# EAGLE design alu_xor_2bits (EAGLE 6.1)
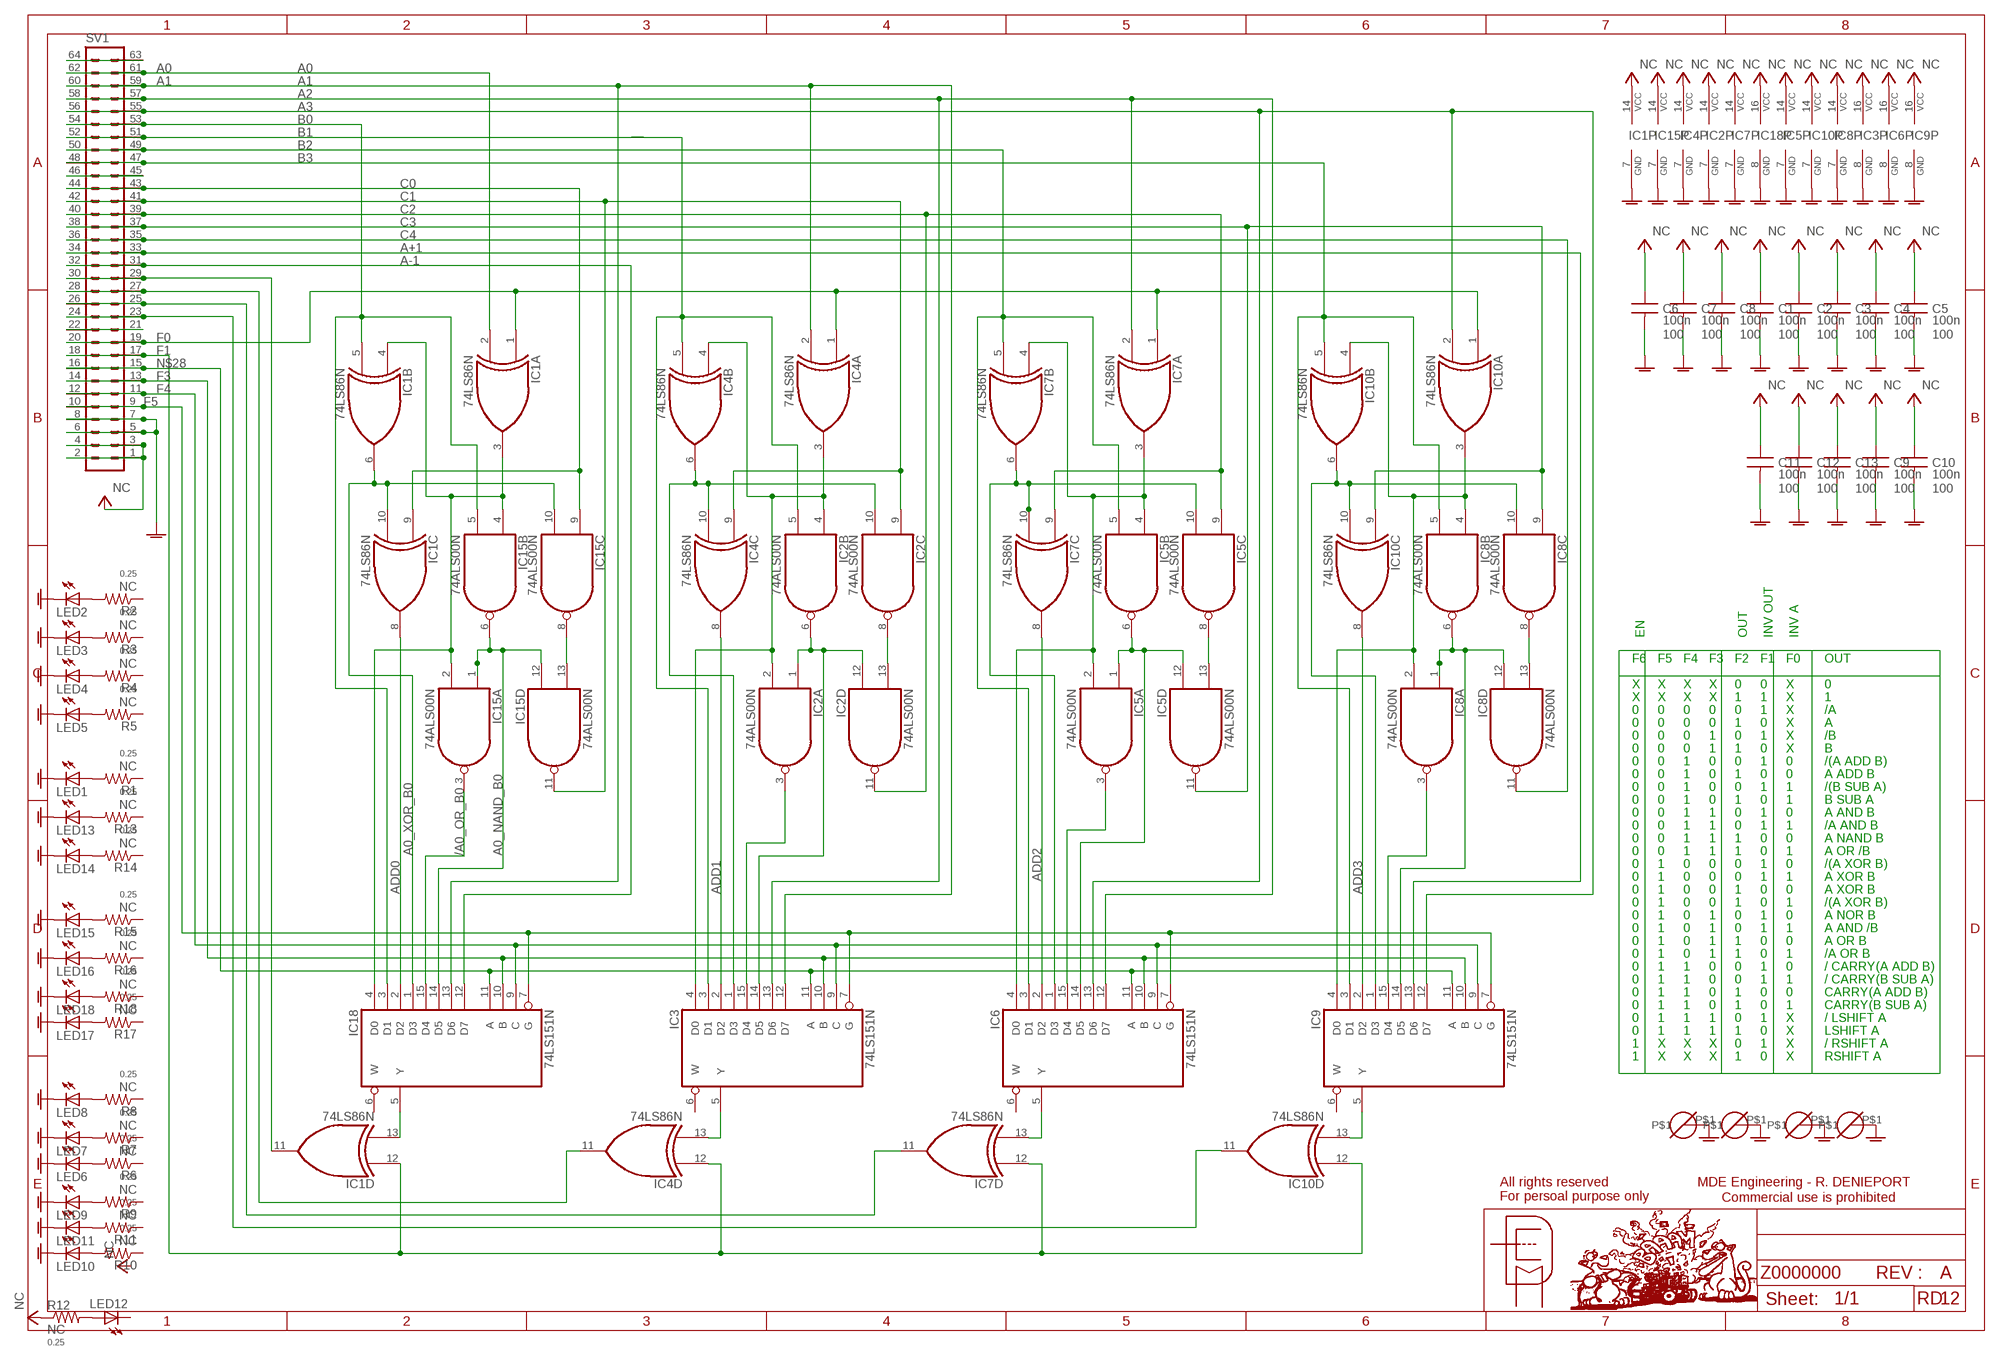
[diagram p0: schematic, sheet 1]
FRAME1 (A3L-LOC): DOC: Z0000000; PCB: A0000000; REV: A; VALUE: NC; YR: 12

## Parts
C1  100n  C2  [C050-030X075]
C2  100n  C2  [C050-030X075]
C3  100n  C2  [C050-030X075]
C4  100n  C2  [C050-030X075]
C5  100n  C2  [C050-030X075]
C6  100n  C2  [C050-030X075]
C7  100n  C2  [C050-030X075]
C8  100n  C2  [C050-030X075]
C9  100n  C2  [C050-030X075]
C10  100n  C2  [C050-030X075]
C11  100n  C2  [C050-030X075]
C12  100n  C2  [C050-030X075]
C13  100n  C2  [C050-030X075]
IC1  74LS86N  [DIL14]
IC2  74ALS00N  [DIL14]
IC3  74LS151N  [DIL16]
IC4  74LS86N  [DIL14]
IC5  74ALS00N  [DIL14]
IC6  74LS151N  [DIL16]
IC7  74LS86N  [DIL14]
IC8  74ALS00N  [DIL14]
IC9  74LS151N  [DIL16]
IC10  74LS86N  [DIL14]
IC15  74ALS00N  [DIL14]
IC18  74LS151N  [DIL16]
LED1  LED3MM  [LED3MM]
LED2  LED3MM  [LED3MM]
LED3  LED3MM  [LED3MM]
LED4  LED3MM  [LED3MM]
LED5  LED3MM  [LED3MM]
LED6  LED3MM  [LED3MM]
LED7  LED3MM  [LED3MM]
LED8  LED3MM  [LED3MM]
LED9  LED3MM  [LED3MM]
LED10  LED3MM  [LED3MM]
LED11  LED3MM  [LED3MM]
LED12  LED3MM  [LED3MM]
LED13  LED3MM  [LED3MM]
LED14  LED3MM  [LED3MM]
LED15  LED3MM  [LED3MM]
LED16  LED3MM  [LED3MM]
LED17  LED3MM  [LED3MM]
LED18  LED3MM  [LED3MM]
R1  NC  R0207H10  [0207/10]
R2  NC  R0207H10  [0207/10]
R3  NC  R0207H10  [0207/10]
R4  NC  R0207H10  [0207/10]
R5  NC  R0207H10  [0207/10]
R6  NC  R0207H10  [0207/10]
R7  NC  R0207H10  [0207/10]
R8  NC  R0207H10  [0207/10]
R9  NC  R0207H10  [0207/10]
R10  NC  R0207H10  [0207/10]
R11  NC  R0207H10  [0207/10]
R12  NC  R0207H10  [0207/10]
R13  NC  R0207H10  [0207/10]
R14  NC  R0207H10  [0207/10]
R15  NC  R0207H10  [0207/10]
R16  NC  R0207H10  [0207/10]
R17  NC  R0207H10  [0207/10]
R18  NC  R0207H10  [0207/10]
SV1  ML64L  [ML64L]
U$1  BANANE_2  [PAD_BANANE]
U$2  BANANE_2  [PAD_BANANE]
U$3  BANANE_2  [PAD_BANANE]
U$4  BANANE_2  [PAD_BANANE]

## Nets
+5V: C1.1 C2.1 C3.1 C4.1 C5.1 C6.1 C7.1 C8.1 C9.1 C10.1 C11.1 C12.1 C13.1 IC1.14(P:VCC) IC2.14(P:VCC) IC3.16(VCC) IC4.14(P:VCC) IC5.14(P:VCC) IC6.16(VCC) IC7.14(P:VCC) IC8.14(P:VCC) IC9.16(VCC) IC10.14(P:VCC) IC15.14(P:VCC) IC18.16(VCC) R12.1 SV1.1 SV1.2 SV1.3 SV1.4 ; supply symbol labelled NC
/A0_OR_B0: IC15.3(A:O) IC18.15(D4)
A0: IC1.2(A:I1) SV1.61 SV1.62
A0_NAND_B0: IC15.1(A:I0) IC15.6(B:O) IC15.12(D:I0) IC18.14(D5)
A0_XOR_B0: IC1.6(B:O) IC1.10(C:I1) IC15.10(C:I1) IC18.1(D3)
A1: IC3.12(D7) IC4.2(A:I1) IC18.13(D6) SV1.59 SV1.60
A2: IC3.13(D6) IC6.12(D7) IC7.2(A:I1) SV1.57 SV1.58
A3: IC6.13(D6) IC9.12(D7) IC10.2(A:I1) SV1.55 SV1.56
A+1: IC9.13(D6) SV1.33 SV1.34
A-1: IC18.12(D7) SV1.31 SV1.32
ADD0: IC1.8(C:O) IC18.2(D2)
ADD1: IC3.2(D2) IC4.8(C:O)
ADD2: IC6.2(D2) IC7.8(C:O)
ADD3: IC9.2(D2) IC10.8(C:O)
B0: IC1.5(B:I1) IC15.5(B:I1) IC18.3(D1) SV1.53 SV1.54
B1: IC2.5(B:I1) IC3.3(D1) IC4.5(B:I1) SV1.51 SV1.52
B2: IC5.5(B:I1) IC6.3(D1) IC7.5(B:I1) SV1.49 SV1.50
B3: IC8.5(B:I1) IC9.3(D1) IC10.5(B:I1) SV1.47 SV1.48
C0: IC1.9(C:I0) IC15.9(C:I0) SV1.43 SV1.44
C1: IC2.9(C:I0) IC4.9(C:I0) IC15.11(D:O) SV1.41 SV1.42
C2: IC2.11(D:O) IC5.9(C:I0) IC7.9(C:I0) SV1.39 SV1.40
C3: IC5.11(D:O) IC8.9(C:I0) IC10.9(C:I0) SV1.37 SV1.38
C4: IC8.11(D:O) SV1.35 SV1.36
F0: IC1.1(A:I0) IC4.1(A:I0) IC7.1(A:I0) IC10.1(A:I0) SV1.19 SV1.20
F1: IC1.12(D:I0) IC4.12(D:I0) IC7.12(D:I0) IC10.12(D:I0) SV1.17 SV1.18
F3: IC3.10(B) IC6.10(B) IC9.10(B) IC18.10(B) SV1.13 SV1.14
F4: IC3.9(C) IC6.9(C) IC9.9(C) IC18.9(C) SV1.11 SV1.12
F5: IC3.7(G) IC6.7(G) IC9.7(G) IC18.7(G) SV1.9 SV1.10
GNDA: C1.2 C2.2 C3.2 C4.2 C5.2 C6.2 C7.2 C8.2 C9.2 C10.2 C11.2 C12.2 C13.2 IC1.7(P:GND) IC2.7(P:GND) IC3.8(GND) IC4.7(P:GND) IC5.7(P:GND) IC6.8(GND) IC7.7(P:GND) IC8.7(P:GND) IC9.8(GND) IC10.7(P:GND) IC15.7(P:GND) IC18.8(GND) LED1.K(C) LED2.K(C) LED3.K(C) LED4.K(C) LED5.K(C) LED6.K(C) LED7.K(C) LED8.K(C) LED9.K(C) LED10.K(C) LED11.K(C) LED13.K(C) LED14.K(C) LED15.K(C) LED16.K(C) LED17.K(C) LED18.K(C) SV1.5 SV1.6 SV1.7 SV1.8 U$1.P$1 U$2.P$1 U$3.P$1 U$4.P$1 ; supply symbol labelled NC
N$1: SV1.45 SV1.46
N$3: IC2.8(C:O) IC2.13(D:I1)
N$4: LED1.A R1.2
N$5: IC1.3(A:O) IC1.4(B:I0) IC15.2(A:I1) IC15.4(B:I0) IC18.4(D0)
N$6: LED2.A R2.2
N$7: LED3.A R3.2
N$8: LED4.A R4.2
N$9: LED5.A R5.2
N$10: LED6.A R6.2
N$11: LED7.A R7.2
N$12: LED8.A R8.2
N$13: LED9.A R9.2
N$14: LED10.A R10.2
N$15: LED11.A R11.2
N$16: LED12.A R12.2
N$17: LED13.A R13.2
N$19: LED14.A R14.2
N$20: LED15.A R15.2
N$21: IC2.2(A:I1) IC2.4(B:I0) IC3.4(D0) IC4.3(A:O) IC4.4(B:I0)
N$22: LED16.A R16.2
N$23: IC1.13(D:I1) IC18.5(Y)
N$25: LED17.A R17.2
N$26: LED18.A R18.2
N$27: IC3.5(Y) IC4.13(D:I1)
N$28: IC3.11(A) IC6.11(A) IC9.11(A) IC18.11(A) SV1.15 SV1.16
N$29: IC5.8(C:O) IC5.13(D:I1)
N$30: IC1.11(D:O) SV1.29 SV1.30
N$31: SV1.63 SV1.64
N$32: IC5.2(A:I1) IC5.4(B:I0) IC6.4(D0) IC7.3(A:O) IC7.4(B:I0)
N$34: IC6.5(Y) IC7.13(D:I1)
N$35: IC2.10(C:I1) IC3.1(D3) IC4.6(B:O) IC4.10(C:I1)
N$36: IC8.8(C:O) IC8.13(D:I1)
N$37: IC8.2(A:I1) IC8.4(B:I0) IC9.4(D0) IC10.3(A:O) IC10.4(B:I0)
N$39: IC9.5(Y) IC10.13(D:I1)
N$40: IC2.3(A:O) IC3.15(D4)
N$41: IC2.1(A:I0) IC2.6(B:O) IC2.12(D:I0) IC3.14(D5)
N$42: IC5.10(C:I1) IC6.1(D3) IC7.6(B:O) IC7.10(C:I1)
N$44: IC5.1(A:I0) IC5.6(B:O) IC5.12(D:I0) IC6.14(D5)
N$45: SV1.21 SV1.22
N$46: IC10.11(D:O) SV1.23 SV1.24
N$47: IC7.11(D:O) SV1.25 SV1.26
N$48: IC4.11(D:O) SV1.27 SV1.28
N$49: IC5.3(A:O) IC6.15(D4)
N$50: IC8.3(A:O) IC9.15(D4)
N$51: IC8.1(A:I0) IC8.6(B:O) IC8.12(D:I0) IC9.14(D5)
N$52: IC8.10(C:I1) IC9.1(D3) IC10.6(B:O) IC10.10(C:I1)
N$61: IC15.8(C:O) IC15.13(D:I1)
Unconnected: IC3.6(W) IC6.6(W) IC9.6(W) IC18.6(W) LED12.K(C) R1.1 R2.1 R3.1 R4.1 R5.1 R6.1 R7.1 R8.1 R9.1 R10.1 R11.1 R13.1 R14.1 R15.1 R16.1 R17.1 R18.1

## Notes on the sheet
- EN | OUT | INV OUT | INV A
- F6 | F5 | F4 | F3 | F2 | F1 | F0 | OUT
- X | X | X | X | 0 | 0 | X | 0
- X | X | X | X | 1 | 1 | X | 1
- 0 | 0 | 0 | 0 | 0 | 1 | X | /A
- 0 | 0 | 0 | 0 | 1 | 0 | X | A
- 0 | 0 | 0 | 1 | 0 | 1 | X | /B
- 0 | 0 | 0 | 1 | 1 | 0 | X | B
- 0 | 0 | 1 | 0 | 0 | 1 | 0 | /(A ADD B)
- 0 | 0 | 1 | 0 | 1 | 0 | 0 | A ADD B
- 0 | 0 | 1 | 0 | 0 | 1 | 1 | /(B SUB A)
- 0 | 0 | 1 | 0 | 1 | 0 | 1 | B SUB A
- 0 | 0 | 1 | 1 | 0 | 1 | 0 | A AND B
- 0 | 0 | 1 | 1 | 0 | 1 | 1 | /A AND B
- 0 | 0 | 1 | 1 | 1 | 0 | 0 | A NAND B
- 0 | 0 | 1 | 1 | 1 | 0 | 1 | A OR /B
- 0 | 1 | 0 | 0 | 0 | 1 | 0 | /(A XOR B)
- 0 | 1 | 0 | 0 | 0 | 1 | 1 | A XOR B
- 0 | 1 | 0 | 0 | 1 | 0 | 0 | A XOR B
- 0 | 1 | 0 | 0 | 1 | 0 | 1 | /(A XOR B)
- 0 | 1 | 0 | 1 | 0 | 1 | 0 | A NOR B
- 0 | 1 | 0 | 1 | 0 | 1 | 1 | A AND /B
- 0 | 1 | 0 | 1 | 1 | 0 | 0 | A OR B
- 0 | 1 | 0 | 1 | 1 | 0 | 1 | /A OR B
- 0 | 1 | 1 | 0 | 0 | 1 | 0 | / CARRY(A ADD B)
- 0 | 1 | 1 | 0 | 0 | 1 | 1 | / CARRY(B SUB A)
- 0 | 1 | 1 | 0 | 1 | 0 | 0 | CARRY(A ADD B)
- 0 | 1 | 1 | 0 | 1 | 0 | 1 | CARRY(B SUB A)
- 0 | 1 | 1 | 1 | 0 | 1 | X | / LSHIFT A
- 0 | 1 | 1 | 1 | 1 | 0 | X | LSHIFT A
- 1 | X | X | X | 0 | 1 | X | / RSHIFT A
- 1 | X | X | X | 1 | 0 | X | RSHIFT A

## Library data of the parts
C1-C13 = MDE:C; GEOMETRIE: 2.5X7.5; TENSION: 100; TYPE: CONDENSATEUR
IC1 IC4 IC7 IC10 = 74xx-us:74*86: Quad 2-input EXCLUSIV-OR (XOR) gate
IC2 IC5 IC8 IC15 = 74xx-us:74*00: Quad 2-input NAND gate
IC3 IC6 IC9 IC18 = 74xx-us:74*151: Data SELECTOR/MULTIPLEXER
LED1-LED18 = led:LED: LED OSRAM: - CHIPLED LG R971, LG N971, LY N971, LG Q971, LY Q971, LO R971, LY R971 LH N974, LH R974 LS Q976, LO Q976, LY Q976 LO Q996 - Hyper CHIPLED LW Q18S LB Q993, LB Q99A, LB R99A - SideLED LS A670, LO A670, LY A670, LG A670, LP A670 LB A673, LV A673, LT A673, LW A673 LH A674 LY A675 LS A676, LA A676, LO A676, LY A676, LW A676 LS A679, LY A679, LG A679 - Hyper Micro SIDELED® LS Y876, LA Y876, LO Y876, LY Y876 LT Y87S - SmartLED LW L88C, LW L88S LB L89C, LB L89S, LG L890 LS L89K, LO L89K, LY L89K LS L896, LA L896, LO L896, LY L896 - TOPLED LS T670, LO T670, LY T670, LG T670, LP T670 LSG T670, LSP T670, LSY T670, LOP T670, LYG T670 LG T671, LOG T671, LSG T671 LB T673, LV T673, LT T673, LW T673 LH T674 LS T676, LA T676, LO T676, LY T676, LB T676, LH T676, LSB T676, LW T676 LB T67C, LV T67C, LT T67C, LS T67K, LO T67K, LY T67K, LW E67C LS E67B, LA E67B, LO E67B, LY E67B, LB E67C, LV E67C, LT E67C LW T67C LS T679, LY T679, LG T679 LS T770, LO T770, LY T770, LG T770, LP T770 LB T773, LV T773, LT T773, LW T773 LH T774 LS E675, LA E675, LY E675, LS T675 LS T776, LA T776, LO T776, LY T776, LB T776 LHGB T686 LT T68C, LB T68C - Hyper Mini TOPLED® LB M676 - Mini TOPLED Santana® LG M470 LS M47K, LO M47K, LY M47K Source: http://www.osram.convergy.de LUXEON: - LUMILED® LXK2-PW12-R00, LXK2-PW12-S00, LXK2-PW14-U00, LXK2-PW14-V00 LXK2-PM12-R00, LXK2-PM12-S00, LXK2-PM14-U00 LXK2-PE12-Q00, LXK2-PE12-R00, LXK2-PE12-S00, LXK2-PE14-T00, LXK2-PE14-U00 LXK2-PB12-K00, LXK2-PB12-L00, LXK2-PB12-M00, LXK2-PB14-N00, LXK2-PB14-P00, LXK2-PB14-Q00 LXK2-PR12-L00, LXK2-PR12-M00, LXK2-PR14-Q00, LXK2-PR14-R00 LXK2-PD12-Q00, LXK2-PD12-R00, LXK2-PD12-S00 LXK2-PH12-R00, LXK2-PH12-S00 LXK2-PL12-P00, LXK2-PL12-Q00, LXK2-PL12-R00 Source: www.luxeon.com KINGBRIGHT: KA-3528ASYC Source: www.kingbright.com
R1-R18 = MDE:R; GEOMETRIE: 0207; PUISSANCE: 0.25; TYPE: RESISTANCE
SV1 = con-harting-ml:ML64: HARTING; OC_FARNELL: unknown; OC_NEWARK: unknown
U$1-U$4 = MDE:BANANE_2

## Board
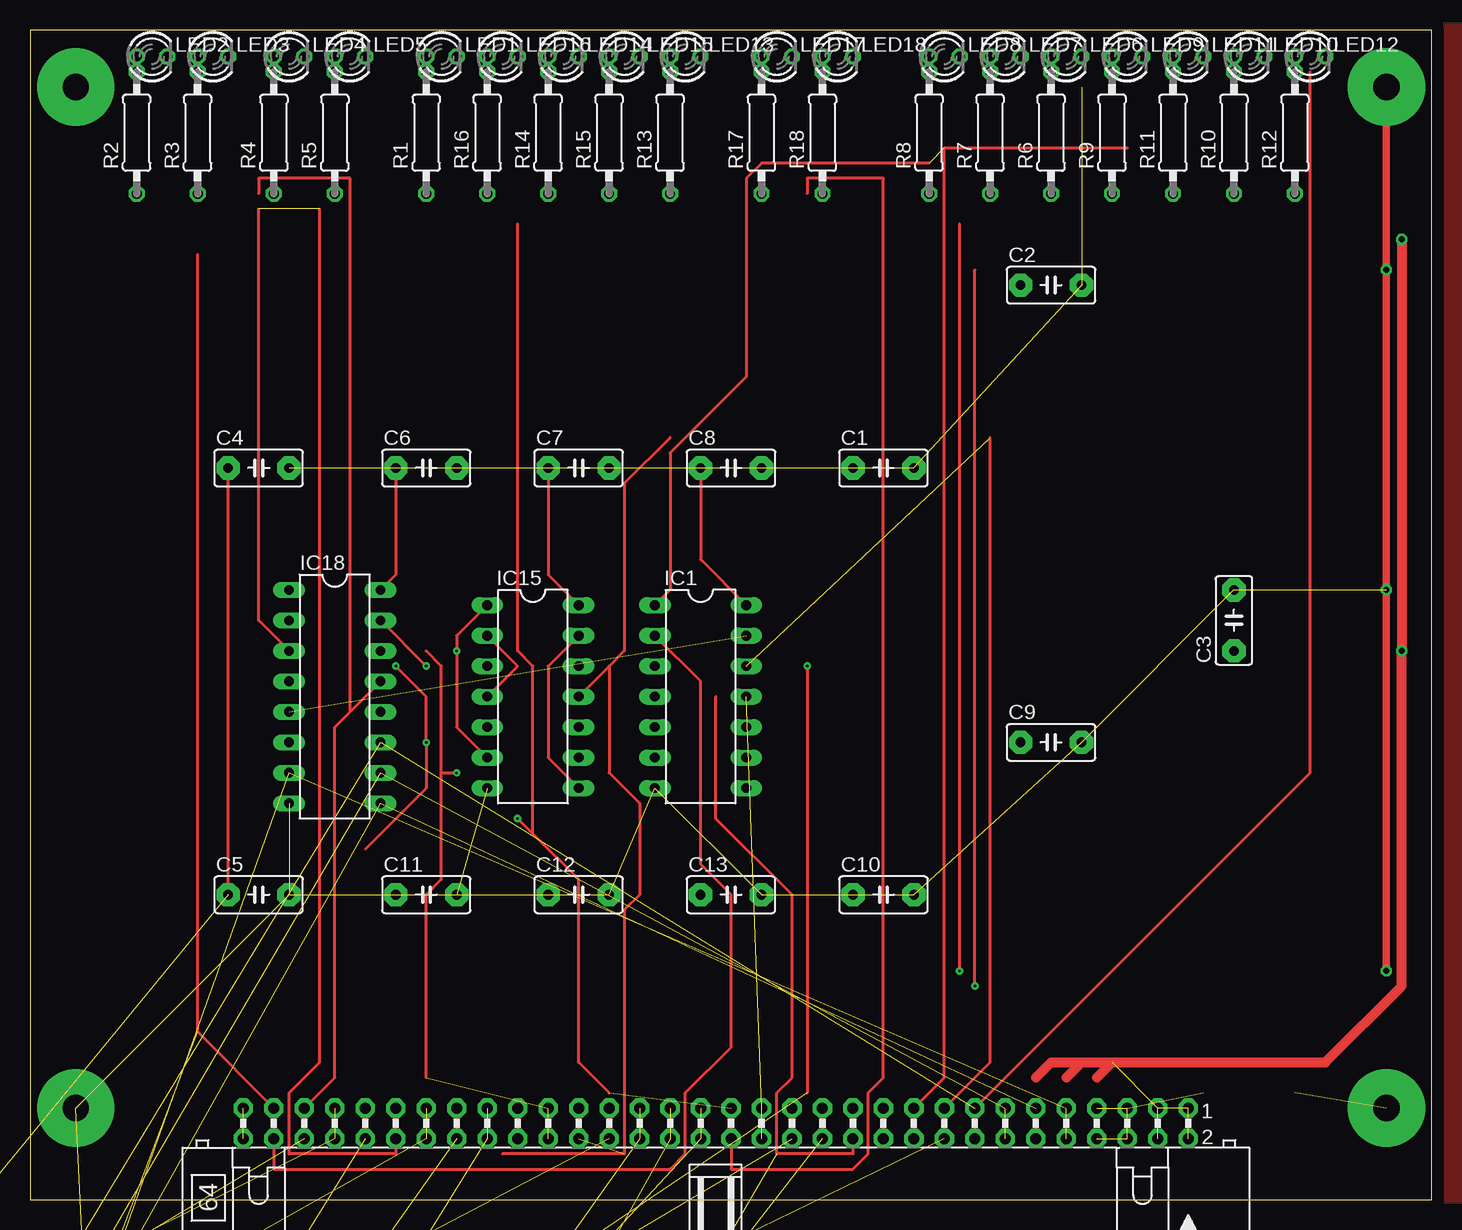
[diagram p1: board, top side]
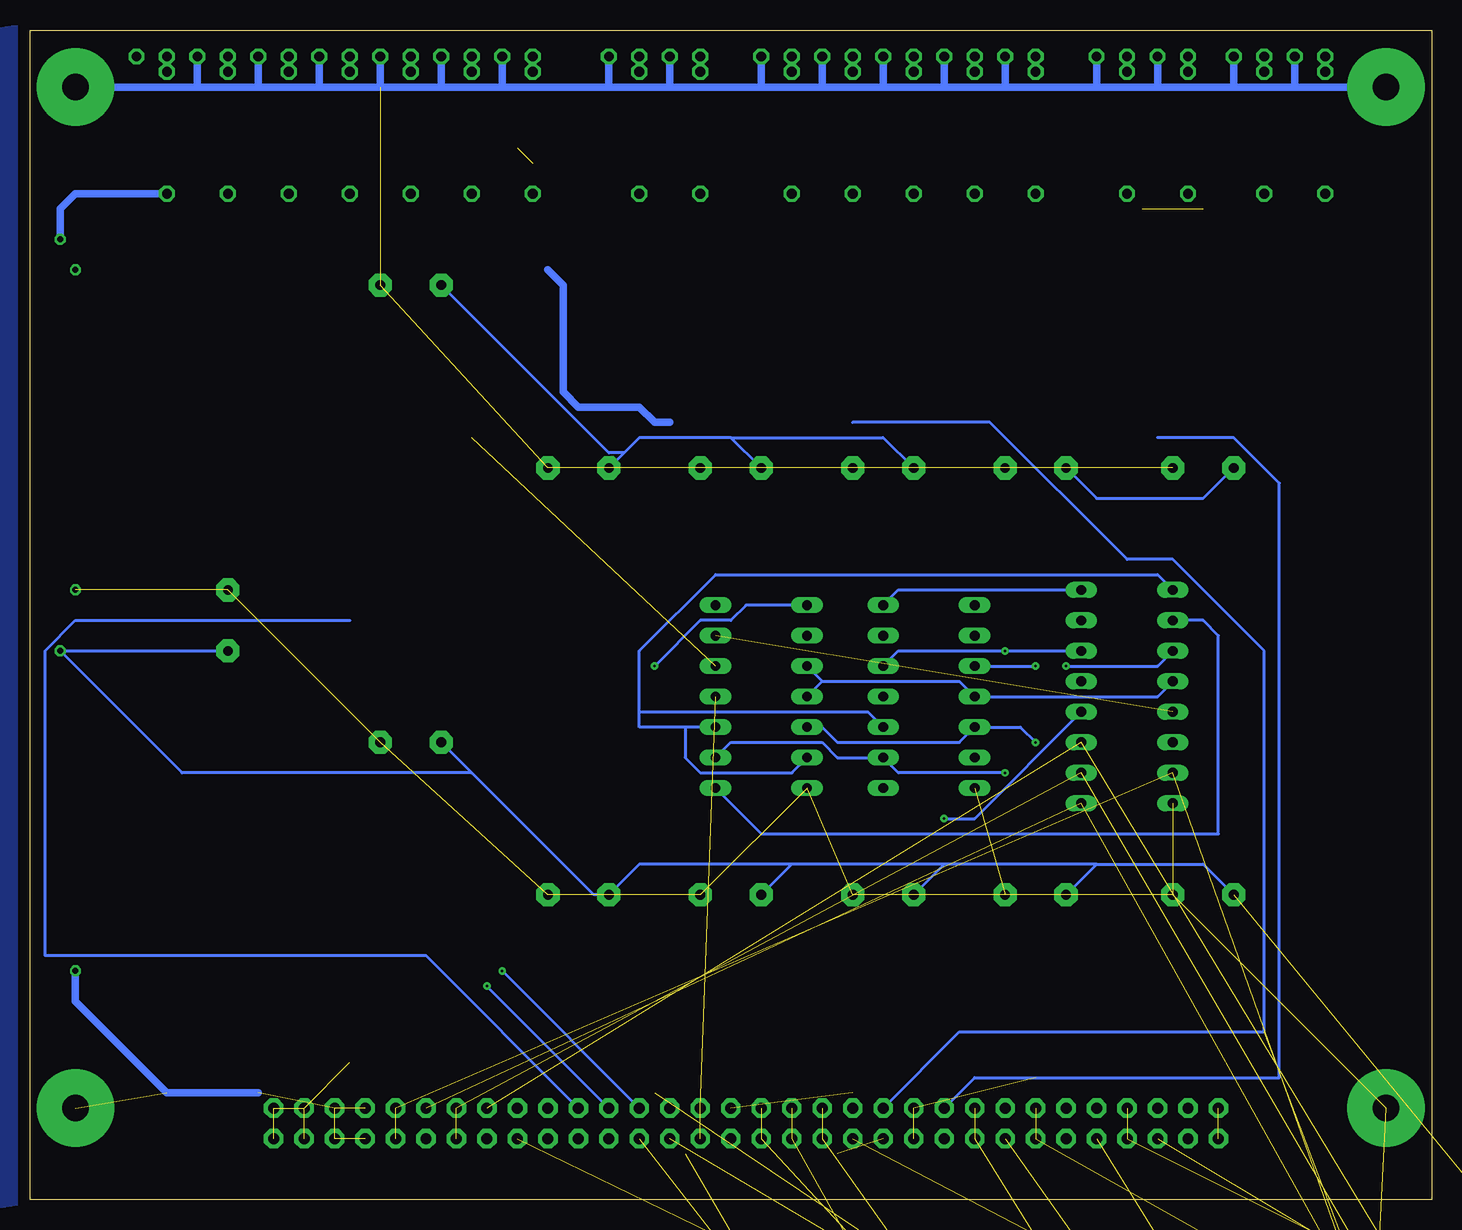
[diagram p2: board, bottom side, seen from below]

Size 116.82 x 97.46 mm. Coordinates in mm from the lower left corner, seen from the top.
Outline: 0,0 116.82,0 116.82,97.46 0,97.46 0,0
Copper layers (1*16): Top 0.035mm / dielectric 1.5mm / Bottom 0.035mm
Design rules: minimum track width 10mil, minimum drill 0.21mm, track to track 11mil, track to pad 12mil, pad to pad 12mil, via to via 12mil, smd to smd 8mil, copper to edge 40mil, drill to drill 8mil, minimum pad ring 10mil, minimum via ring 8mil, stop-mask expansion 4mil, vias tented up to drill 0mil, thermal gap 10mil

### Footprints (pad centres in the part's own frame; a part is rotated, then mirrored left to right if it is on the bottom)
C050-030X075 = drill 0.813 pad 1.93 octagon: 1 -2.54,0; 2 2.54,0
DIL14 = drill 0.813 long: 1 -7.62,-3.81; 2 -5.08,-3.81; 3 -2.54,-3.81; 4 0,-3.81; 5 2.54,-3.81; 6 5.08,-3.81; 7 7.62,-3.81; 8 7.62,3.81; 9 5.08,3.81; 10 2.54,3.81; 11 0,3.81; 12 -2.54,3.81; 13 -5.08,3.81; 14 -7.62,3.81
DIL16 = drill 0.813 long: 1 -8.89,-3.81; 2 -6.35,-3.81; 3 -3.81,-3.81; 4 -1.27,-3.81; 5 1.27,-3.81; 6 3.81,-3.81; 7 6.35,-3.81; 8 8.89,-3.81; 9 8.89,3.81; 10 6.35,3.81; 11 3.81,3.81; 12 1.27,3.81; 13 -1.27,3.81; 14 -3.81,3.81; 15 -6.35,3.81; 16 -8.89,3.81
LED3MM = drill 0.813 octagon: A -1.27,0; K 1.27,0
0207/10 = drill 0.813 octagon: 1 -5.08,0; 2 5.08,0
ML64L = drill 0.914 pad 1.6 octagon: 1 -39.37,-1.27; 2 -39.37,1.27; 3 -36.83,-1.27; 4 -36.83,1.27; 5 -34.29,-1.27; 6 -34.29,1.27; 7 -31.75,-1.27; 8 -31.75,1.27; 9 -29.21,-1.27; 10 -29.21,1.27; 11 -26.67,-1.27; 12 -26.67,1.27; 13 -24.13,-1.27; 14 -24.13,1.27; 15 -21.59,-1.27; 16 -21.59,1.27; 17 -19.05,-1.27; 18 -19.05,1.27; 19 -16.51,-1.27; 20 -16.51,1.27; 21 -13.97,-1.27; 22 -13.97,1.27; 23 -11.43,-1.27; 24 -11.43,1.27; 25 -8.89,-1.27; 26 -8.89,1.27; 27 -6.35,-1.27; 28 -6.35,1.27; 29 -3.81,-1.27; 30 -3.81,1.27; 31 -1.27,-1.27; 32 -1.27,1.27; 33 1.27,-1.27; 34 1.27,1.27; 35 3.81,-1.27; 36 3.81,1.27; 37 6.35,-1.27; 38 6.35,1.27; 39 8.89,-1.27; 40 8.89,1.27; 41 11.43,-1.27; 42 11.43,1.27; 43 13.97,-1.27; 44 13.97,1.27; 45 16.51,-1.27; 46 16.51,1.27; 47 19.05,-1.27; 48 19.05,1.27; 49 21.59,-1.27; 50 21.59,1.27; 51 24.13,-1.27; 52 24.13,1.27; 53 26.67,-1.27; 54 26.67,1.27; 55 29.21,-1.27; 56 29.21,1.27; 57 31.75,-1.27; 58 31.75,1.27; 59 34.29,-1.27; 60 34.29,1.27; 61 36.83,-1.27; 62 36.83,1.27; 63 39.37,-1.27; 64 39.37,1.27
PAD_BANANE = drill 2.2 pad 6.452: P$1 0,0

### Placement (x,y rotation side)
C1  71.12,60.96 0 top
C2  85.09,76.2 0 top
C3  100.33,48.26 90 top
C4  19.05,60.96 0 top
C5  19.05,25.4 0 top
C6  33.02,60.96 0 top
C7  45.72,60.96 0 top
C8  58.42,60.96 0 top
C9  85.09,38.1 0 top
C10  71.12,25.4 0 top
C11  33.02,25.4 0 top
C12  45.72,25.4 0 top
C13  58.42,25.4 0 top
IC1  55.88,41.91 270 top
IC2  -5.08,-26.67 0 top  (outside the outline)
IC3  -3.81,-13.97 0 top  (outside the outline)
IC4  -5.08,-39.37 0 top  (outside the outline)
IC5  -5.08,-77.47 0 top  (outside the outline)
IC6  -3.81,-52.07 0 top  (outside the outline)
IC7  -5.08,-90.17 0 top  (outside the outline)
IC8  -5.08,-102.87 0 top  (outside the outline)
IC9  -3.81,-64.77 0 top  (outside the outline)
IC10  -5.08,-115.57 0 top  (outside the outline)
IC15  41.91,41.91 270 top
IC18  25.4,41.91 270 top
LED1  34.29,95.25 0 top
LED2  10.16,95.25 0 top
LED3  15.24,95.25 0 top
LED4  21.59,95.25 0 top
LED5  26.67,95.25 0 top
LED6  86.36,95.25 0 top
LED7  81.28,95.25 0 top
LED8  76.2,95.25 0 top
LED9  91.44,95.25 0 top
LED10  101.6,95.25 0 top
LED11  96.52,95.25 0 top
LED12  106.68,95.25 0 top
LED13  54.61,95.25 0 top
LED14  44.45,95.25 0 top
LED15  49.53,95.25 0 top
LED16  39.37,95.25 0 top
LED17  62.23,95.25 0 top
LED18  67.31,95.25 0 top
R1  33.02,88.9 90 top
R2  8.89,88.9 90 top
R3  13.97,88.9 90 top
R4  20.32,88.9 90 top
R5  25.4,88.9 90 top
R6  85.09,88.9 90 top
R7  80.01,88.9 90 top
R8  74.93,88.9 90 top
R9  90.17,88.9 90 top
R10  100.33,88.9 90 top
R11  95.25,88.9 90 top
R12  105.41,88.9 90 top
R13  53.34,88.9 90 top
R14  43.18,88.9 90 top
R15  48.26,88.9 90 top
R16  38.1,88.9 90 top
R17  60.96,88.9 90 top
R18  66.04,88.9 90 top
SV1  57.15,6.35 180 top
U$1  3.81,7.62 0 top
U$2  113.03,7.62 0 top
U$3  3.81,92.71 0 top
U$4  113.03,92.71 0 top

### Tracks (layer width: path | path; a pad name or v marks a point on that pad's centre or on a via)
+5V  (via drill 0.5 pad 0.81)  (13 unrouted)
  Top 0.254: IC18.16 30.48,52.07 C6.1 | IC15.14 43.18,52.07 C7.1 | IC1.14 55.88,53.34 C8.1 | C5.1 C4.1
  Top 0.813: v114.3,80.01 v114.3,45.72 114.3,17.78 107.95,11.43 90.17,11.43 | 83.82,10.16 85.09,11.43 87.63,11.43 | 87.63,11.43 90.17,11.43 | 86.36,10.16 87.63,11.43 | 88.9,10.16 90.17,11.43
  Bottom 0.254: C4.1 19.05,58.42 27.94,58.42 C6.1 | 67.31,62.23 66.04,63.5 58.42,63.5 | 67.31,62.23 C1.1 | C8.1 58.42,63.5 | C2.1 68.58,62.23 67.31,62.23 | C7.1 45.72,63.5 58.42,63.5 | IC18.16 44.45,50.8 IC15.14 | C3.1 v114.3,45.72 104.14,35.56 80.01,35.56 | C5.1 19.05,27.94 27.94,27.94 | C11.1 27.94,27.94 | 40.64,27.94 C12.1 | 27.94,27.94 40.64,27.94 | 53.34,27.94 C13.1 | 40.64,27.94 53.34,27.94 | 53.34,27.94 66.04,27.94 C10.1 69.85,25.4 80.01,35.56 | 80.01,35.56 C9.1
  Bottom 0.61: R12.1 113.03,83.82 114.3,82.55 v114.3,80.01
/A0_OR_B0  (via drill 0.21)
  Top 0.254: v33.02,44.45 IC18.15
  Bottom 0.254: IC15.3 v33.02,44.45
A0
  Top 0.254: IC1.2 55.88,43.18 55.88,27.94 58.42,25.4 58.42,12.7 54.61,8.89 54.61,3.81 53.34,2.54 20.32,2.54 SV1.62 SV1.61 13.97,13.97 13.97,78.74
A0_NAND_B0  (via drill 0.21)
  Top 0.254: IC15.6 35.56,39.37 v35.56,45.72 35.56,46.99 IC15.1
  Bottom 0.254: IC18.14 v35.56,45.72 44.45,45.72 IC15.12
A0_XOR_B0
  Bottom 0.254: IC1.6 53.34,35.56 60.96,35.56 62.23,36.83 62.23,39.37 | IC1.10 62.23,39.37 | IC18.1 22.86,52.07 59.69,52.07 66.04,45.72 66.04,40.64 | 66.04,40.64 66.04,39.37 62.23,39.37 | IC15.10 46.99,40.64 66.04,40.64
A1  (2 unrouted)
  Top 0.254: 26.67,40.64 25.4,39.37 25.4,10.16 SV1.59 SV1.60 | 26.67,40.64 IC18.13 | 19.05,83.82 19.05,85.09 26.67,85.09 26.67,40.64
A2  (4 unrouted)
A3  (3 unrouted)
  Top 0.254: SV1.55 SV1.56
A+1  (2 unrouted)
A-1  (via drill 0.21)  (1 unrouted)
  Top 0.254: 41.91,30.48 45.72,26.67 45.72,11.43 48.26,8.89 | 41.91,30.48 v40.64,31.75 | 40.64,81.28 40.64,45.72 41.91,44.45 41.91,30.48 | 64.77,83.82 64.77,85.09 71.12,85.09 71.12,10.16 69.85,8.89 69.85,3.81 68.58,2.54 58.42,2.54 SV1.32 SV1.31
  Bottom 0.254: IC18.12 38.1,31.75 v40.64,31.75
ADD0
  Bottom 0.254: IC18.2 19.05,48.26 17.78,46.99 17.78,30.48 55.88,30.48 IC1.8
ADD1  (1 unrouted)
ADD2  (1 unrouted)
ADD3  (1 unrouted)
B0  (via drill 0.21)  (1 unrouted)
  Top 0.254: 19.05,82.55 19.05,48.26 IC18.3 | 27.94,29.21 33.02,34.29 v33.02,38.1 33.02,41.91 v30.48,44.45 | 24.13,82.55 24.13,11.43 21.59,8.89 21.59,3.81 30.48,3.81 SV1.54 SV1.53
  Bottom 0.254: IC1.5 50.8,39.37 49.53,38.1 39.37,38.1 IC15.5 34.29,39.37 v33.02,38.1 | IC18.3 22.86,44.45 v30.48,44.45
B1  (4 unrouted)
B2  (3 unrouted)
  Top 0.254: SV1.49 SV1.50
B3  (4 unrouted)
C0  (via drill 0.21)  (2 unrouted)
  Top 0.254: 33.02,45.72 34.29,44.45 34.29,35.56 | 34.29,35.56 34.29,26.67 33.02,25.4 33.02,10.16 | 34.29,35.56 v35.56,35.56
  Bottom 0.254: IC1.9 58.42,38.1 50.8,38.1 49.53,36.83 IC15.9 44.45,35.56 v35.56,35.56
C1  (3 unrouted)
  Top 0.254: 48.26,44.45 49.53,45.72 49.53,59.69 53.34,63.5 | 48.26,44.45 IC15.11 | 39.37,3.81 49.53,3.81 49.53,24.13 50.8,25.4 50.8,33.02 48.26,35.56 48.26,44.45 | SV1.41 SV1.42
  Bottom 0.254: 48.26,64.77 36.83,64.77 25.4,53.34 21.59,53.34 13.97,45.72 13.97,13.97 39.37,13.97 SV1.41
C2  (3 unrouted)
  Top 0.254: SV1.39 SV1.40
C3  (4 unrouted)
C4  (2 unrouted)
F0  (via drill 0.21)  (4 unrouted)
  Top 0.254: IC1.1 53.34,50.8 53.34,62.23 59.69,68.58 59.69,85.09 60.96,86.36 74.93,86.36 | v64.77,44.45 64.77,8.89 | 91.44,87.63 76.2,87.63 76.2,10.16 SV1.19 SV1.20
  Bottom 0.254: v64.77,44.45 60.96,48.26 58.42,48.26 57.15,49.53 IC1.1
F1  (4 unrouted)
  Top 0.254: 80.01,63.5 80.01,11.43 SV1.17 SV1.18
F3  (5 unrouted)
F4  (4 unrouted)
  Top 0.254: SV1.11 SV1.12
F5  (5 unrouted)
GNDA  (via drill 0.5 pad 0.81)  (31 unrouted)
  Top 0.61: U$4.P$1 v113.03,77.47 v113.03,50.8 v113.03,19.05
  Bottom 0.61: LED2.K 11.43,92.71 | 11.43,92.71 16.51,92.71 | 16.51,92.71 22.86,92.71 | 22.86,92.71 27.94,92.71 | 27.94,92.71 35.56,92.71 | 35.56,92.71 40.64,92.71 | 40.64,92.71 45.72,92.71 | 45.72,92.71 50.8,92.71 | 50.8,92.71 55.88,92.71 | 55.88,92.71 63.5,92.71 | 63.5,92.71 68.58,92.71 | 68.58,92.71 77.47,92.71 | 77.47,92.71 82.55,92.71 | 82.55,92.71 87.63,92.71 | 87.63,92.71 92.71,92.71 | 92.71,92.71 97.79,92.71 | 97.79,92.71 102.87,92.71 | 102.87,92.71 LED10.K | LED3.K 16.51,92.71 | LED4.K 22.86,92.71 | LED5.K 27.94,92.71 | LED1.K 35.56,92.71 | LED16.K 40.64,92.71 | LED14.K 45.72,92.71 | LED15.K 50.8,92.71 | LED13.K 55.88,92.71 | LED17.K 63.5,92.71 | LED18.K 68.58,92.71 | LED8.K 77.47,92.71 | LED7.K 82.55,92.71 | LED6.K 87.63,92.71 | LED9.K 92.71,92.71 | LED11.K 97.79,92.71 | 102.87,92.71 U$4.P$1 | U$3.P$1 11.43,92.71 | 97.79,8.89 105.41,8.89 113.03,16.51 v113.03,19.05
  pour Bottom: 124.46,96.52 116.84,97.79 116.84,0 124.46,-1.27
  pour Top: 121.92,97.79 116.84,97.79 116.84,0 121.92,0
N$1
  Top 0.254: SV1.45 SV1.46
  Bottom 0.254: 22.86,63.5 16.51,63.5 12.7,59.69 12.7,10.16 38.1,10.16 SV1.45
N$3  (1 unrouted)
N$4
  Bottom 0.61: R1.2 LED1.A
N$5
  Top 0.254: IC15.2 40.64,44.45 IC15.4
  Bottom 0.254: 50.8,43.18 39.37,43.18 IC15.4 22.86,41.91 IC18.4 | IC1.3 50.8,43.18 | 50.8,43.18 IC1.4
N$6
  Bottom 0.61: LED2.A R2.2
N$7
  Bottom 0.61: R3.2 LED3.A
N$8
  Bottom 0.61: R4.2 LED4.A
N$9
  Bottom 0.61: R5.2 LED5.A
N$10
  Bottom 0.61: R6.2 LED6.A
N$11
  Bottom 0.61: R7.2 LED7.A
N$12
  Bottom 0.61: R8.2 LED8.A
N$13
  Bottom 0.61: R9.2 LED9.A
N$14
  Bottom 0.61: R10.2 LED10.A
N$15
  Bottom 0.61: R11.2 LED11.A
N$16
  Bottom 0.61: R12.2 LED12.A
N$17
  Bottom 0.61: R13.2 LED13.A
N$19
  Bottom 0.61: R14.2 LED14.A
N$20
  Bottom 0.61: R15.2 LED15.A
N$21  (4 unrouted)
N$22
  Bottom 0.61: R16.2 LED16.A
N$23  (1 unrouted)
N$25
  Bottom 0.61: R17.2 LED17.A
N$26
  Bottom 0.61: R18.2 LED18.A
N$27  (1 unrouted)
N$28  (4 unrouted)
  Top 0.254: 106.68,93.98 106.68,35.56 SV1.15 SV1.16
N$29  (1 unrouted)
N$30  (2 unrouted)
N$31  (1 unrouted)
N$32  (4 unrouted)
N$34  (1 unrouted)
N$35  (3 unrouted)
N$36  (1 unrouted)
N$37  (4 unrouted)
N$39  (1 unrouted)
N$40  (1 unrouted)
N$41  (3 unrouted)
N$42  (3 unrouted)
N$44  (3 unrouted)
N$45
  Top 0.254: SV1.21 SV1.22
  Bottom 0.254: 90.17,48.26 113.03,48.26 115.57,45.72 115.57,20.32 83.82,20.32 SV1.21
N$46  (via drill 0.21)  (1 unrouted)
  Top 0.254: 57.15,41.91 57.15,31.75 63.5,25.4 63.5,10.16 62.23,8.89 62.23,3.81 68.58,3.81 SV1.24 SV1.23 | v78.74,17.78 78.74,77.47
  Bottom 0.254: SV1.23 v78.74,17.78
N$47  (via drill 0.21)  (1 unrouted)
  Top 0.254: v77.47,19.05 77.47,81.28 | SV1.25 SV1.26
  Bottom 0.254: SV1.25 v77.47,19.05
N$48  (1 unrouted)
  Top 0.254: SV1.27 SV1.28
N$49  (1 unrouted)
N$50  (1 unrouted)
N$51  (3 unrouted)
N$52  (3 unrouted)
N$60
  Bottom 0.61: 63.5,64.77 64.77,64.77 66.04,66.04 71.12,66.04 72.39,67.31 72.39,76.2 73.66,77.47
N$61
  Top 0.254: IC15.8 43.18,36.83 43.18,44.45 IC15.13